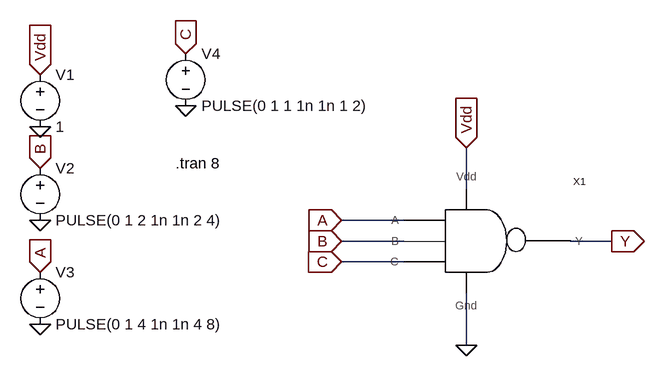
[diagram p0: schematic 3inand_test.asc]
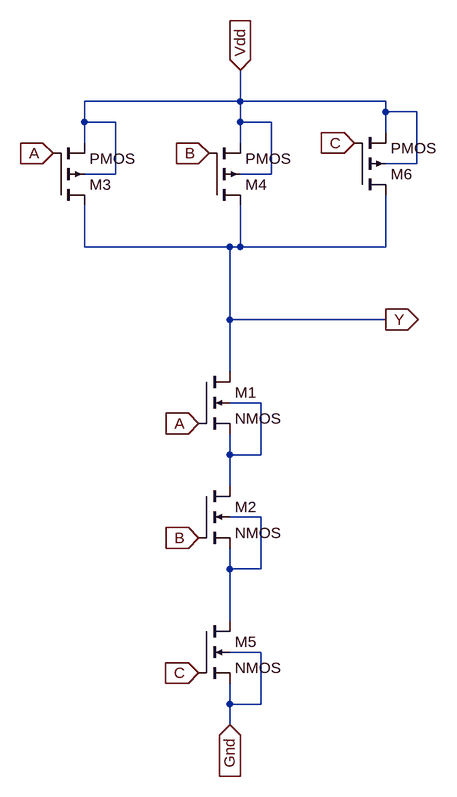
[diagram p1: sub-circuit 3inand.asc]
3inand_test.asc, the LTspice schematic file:
Version 4
SHEET 1 880 680
WIRE 512 112 512 48
WIRE 416 160 320 160
WIRE 416 192 320 192
WIRE 736 192 672 192
WIRE 416 224 320 224
WIRE 512 352 512 272
FLAG -144 -64 Vdd
IOPIN -144 -64 In
FLAG -144 80 B
IOPIN -144 80 In
FLAG -144 240 A
IOPIN -144 240 In
FLAG -144 16 0
FLAG -144 160 0
FLAG -144 320 0
FLAG 80 -96 C
IOPIN 80 -96 In
FLAG 80 -16 0
FLAG 512 352 0
FLAG 320 160 A
IOPIN 320 160 In
FLAG 320 192 B
IOPIN 320 192 In
FLAG 320 224 C
IOPIN 320 224 In
FLAG 512 48 Vdd
IOPIN 512 48 In
FLAG 736 192 Y
IOPIN 736 192 Out
SYMBOL voltage -144 -80 R0
SYMATTR InstName V1
SYMATTR Value 1
SYMBOL voltage -144 64 R0
WINDOW 123 0 0 Left 0
WINDOW 39 0 0 Left 0
SYMATTR InstName V2
SYMATTR Value PULSE(0 1 2 1n 1n 2 4)
SYMBOL voltage -144 224 R0
WINDOW 123 0 0 Left 0
WINDOW 39 0 0 Left 0
SYMATTR InstName V3
SYMATTR Value PULSE(0 1 4 1n 1n 4 8)
SYMBOL voltage 80 -112 R0
WINDOW 123 0 0 Left 0
WINDOW 39 0 0 Left 0
SYMATTR InstName V4
SYMATTR Value PULSE(0 1 1 1n 1n 1 2)
SYMBOL 3inand 512 192 R0
SYMATTR InstName X1
TEXT 64 72 Left 2 !.tran 8

3inand.asc, the sub-circuit schematic file:
Version 4
SHEET 1 880 776
WIRE 256 -288 256 -336
WIRE 256 -288 16 -288
WIRE 480 -288 256 -288
WIRE 480 -272 480 -288
WIRE 528 -272 480 -272
WIRE 16 -256 16 -288
WIRE 64 -256 16 -256
WIRE 256 -256 256 -288
WIRE 304 -256 256 -256
WIRE 480 -240 480 -272
WIRE 16 -224 16 -256
WIRE 256 -224 256 -256
WIRE 528 -192 528 -272
WIRE 528 -192 480 -192
WIRE 64 -176 64 -256
WIRE 64 -176 16 -176
WIRE 304 -176 304 -256
WIRE 304 -176 256 -176
WIRE 16 -64 16 -128
WIRE 240 -64 16 -64
WIRE 256 -64 256 -128
WIRE 256 -64 240 -64
WIRE 480 -64 480 -144
WIRE 480 -64 256 -64
WIRE 240 48 240 -64
WIRE 480 48 240 48
WIRE 240 128 240 48
WIRE 288 176 240 176
WIRE 240 256 240 224
WIRE 288 256 288 176
WIRE 288 256 240 256
WIRE 240 304 240 256
WIRE 288 352 240 352
WIRE 240 432 240 400
WIRE 288 432 288 352
WIRE 288 432 240 432
WIRE 240 512 240 432
WIRE 288 560 240 560
WIRE 240 640 240 608
WIRE 288 640 288 560
WIRE 288 640 240 640
WIRE 240 672 240 640
FLAG 192 384 B
IOPIN 192 384 In
FLAG 192 208 A
IOPIN 192 208 In
FLAG -32 -208 A
IOPIN -32 -208 In
FLAG 208 -208 B
IOPIN 208 -208 In
FLAG 480 48 Y
IOPIN 480 48 Out
FLAG 256 -336 Vdd
IOPIN 256 -336 In
FLAG 192 592 C
IOPIN 192 592 In
FLAG 432 -224 C
IOPIN 432 -224 In
FLAG 240 672 Gnd
IOPIN 240 672 In
SYMBOL nmos4 192 128 R0
SYMATTR InstName M1
SYMBOL nmos4 192 304 R0
SYMATTR InstName M2
SYMBOL pmos4 -32 -128 M180
SYMATTR InstName M3
SYMBOL pmos4 208 -128 M180
SYMATTR InstName M4
SYMBOL nmos4 192 512 R0
SYMATTR InstName M5
SYMBOL pmos4 432 -144 M180
SYMATTR InstName M6

The netlist it stands for:
* 3inand_test.asc
V1 Vdd 0 1
V2 B 0 PULSE(0 1 2 1n 1n 2 4)
V3 A 0 PULSE(0 1 4 1n 1n 4 8)
V4 C 0 PULSE(0 1 1 1n 1n 1 2)
XX1 A B C Vdd 0 Y 3inand

* block symbol definitions
.subckt 3inand A B C Vdd Gnd Y
M1 Y A N001 N001 NMOS
M2 N001 B N002 N002 NMOS
M3 Y A Vdd Vdd PMOS
M4 Y B Vdd Vdd PMOS
M5 N002 C Gnd Gnd NMOS
M6 Y C Vdd Vdd PMOS
.ends 3inand

.model NMOS NMOS
.model PMOS PMOS
.lib standard.mos
.tran 8
.backanno
.end

* Results of the author's LTspice run, read from the files saved beside the schematic
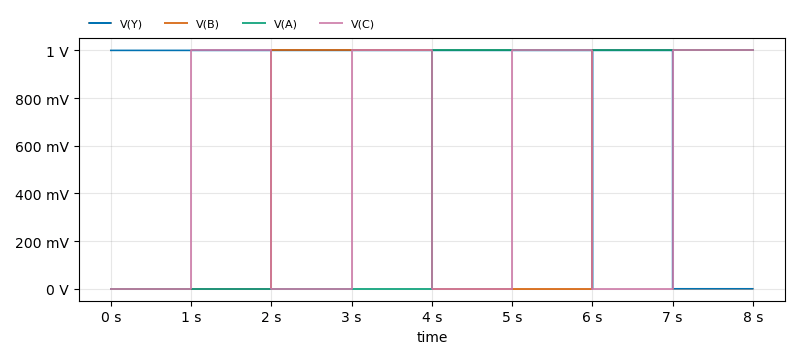
[diagram p2: Transient Analysis of 3inand_test.asc, plotted from the saved traces]
* Transient Analysis, 1 run:
*   V(Y): min 295.3 nV, max 1 V, average 875 mV, rms 935.4 mV, last 904.5 nV
*   V(B): min 0 V, max 1 V, average 500 mV, rms 707.1 mV, last 1 V
*   V(A): min 0 V, max 1 V, average 500 mV, rms 707.1 mV, last 1 V
*   V(C): min 0 V, max 1 V, average 500 mV, rms 707.1 mV, last 1 V